# Altium schematic sheet PowerSupply.SchDoc
size A4; SheetNumber: 2; SheetTotal: 5
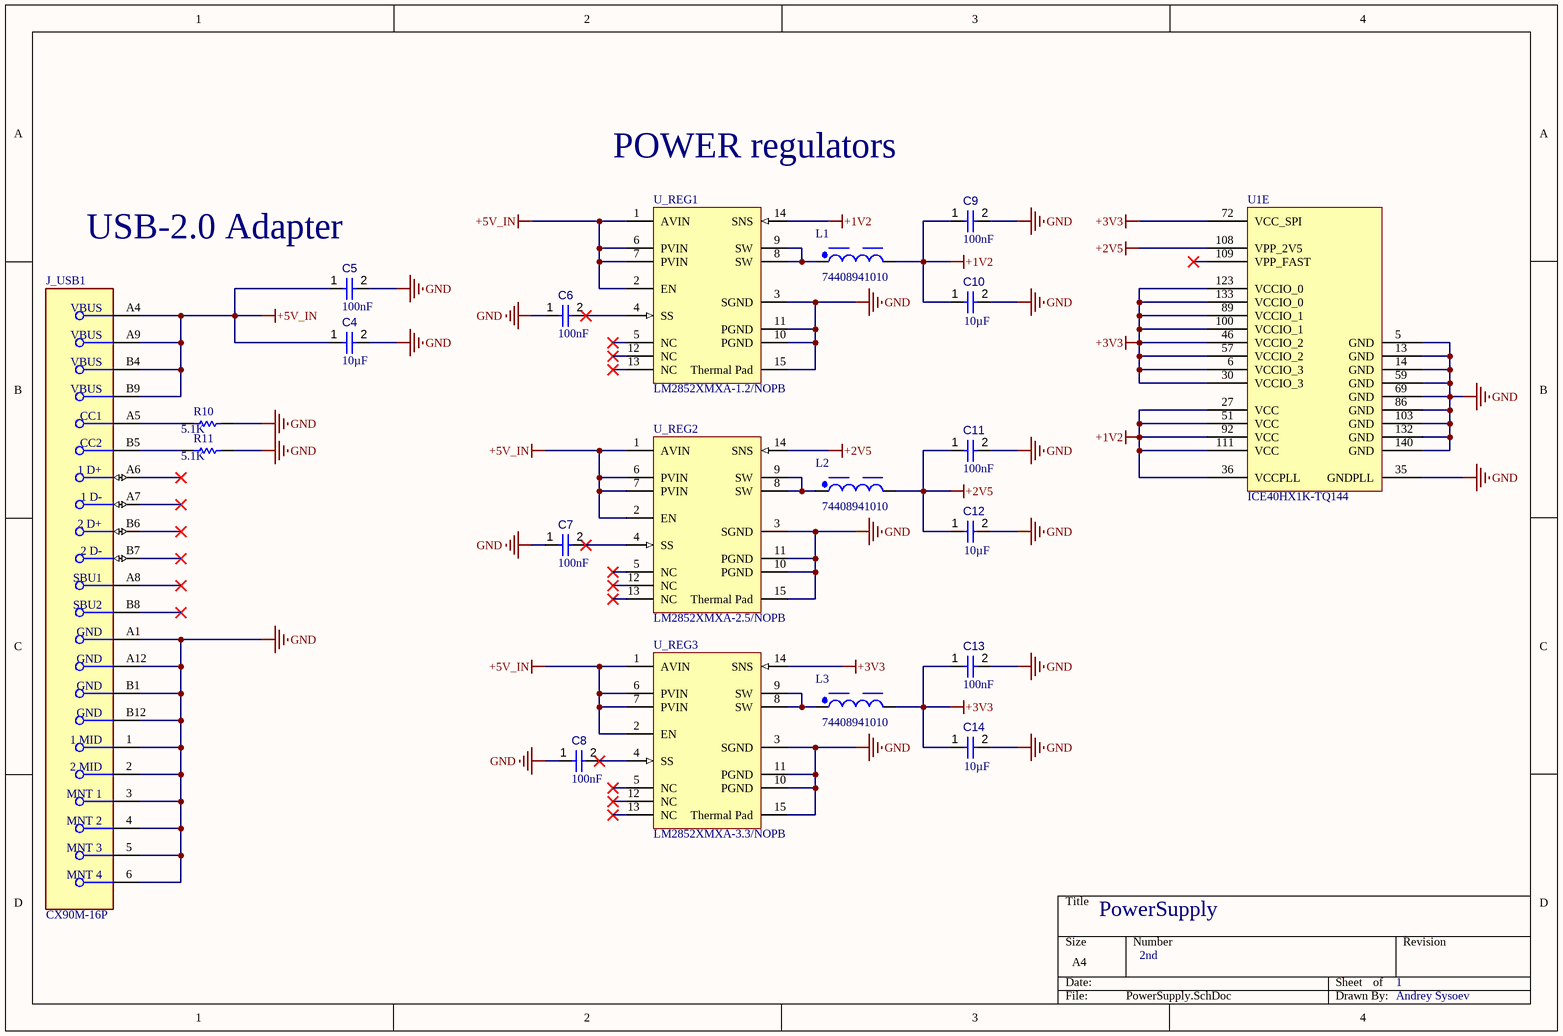
[diagram p0: PowerSupply.SchDoc]

## Parts
C11  value 100nF  [CAPC0402(1005)60_L]  (hidden comment: Capacitor 100nF +/-20% 50V 0402)
C12  value 10µF  [CAPC0603(1608)100_L]  (hidden comment: Capacitor 10µF +/-20% 10V 0603)
C13  value 100nF  [CAPC0402(1005)60_L]  (hidden comment: Capacitor 100nF +/-20% 50V 0402)
C14  value 10µF  [CAPC0603(1608)100_L]  (hidden comment: Capacitor 10µF +/-20% 10V 0603)
J_USB1  CX90M-16P  [FP-CX90M-16P-MFG]
L1  74408941010  [WE-SPC_4818]
L2  74408941010  [WE-SPC_4818]
L3  74408941010  [WE-SPC_4818]
R10  5.1K  [RESC2512(6432)_M]
R11  5.1K  [RESC2512(6432)_M]
U1  ICE40HX1K-TQ144  [LATC-TQFP-144_N]  (part E of 6)
U_REG1  LM2852XMXA-1.2/NOPB  [MXA14A_N]
U_REG2  LM2852XMXA-2.5/NOPB  [MXA14A_N]
U_REG3  LM2852XMXA-3.3/NOPB  [MXA14A_N]
С4  value 10µF  [CAPC0603(1608)100_L]  (hidden comment: Capacitor 10µF +/-20% 10V 0603)
С5  value 100nF  [CAPC0402(1005)60_L]  (hidden comment: Capacitor 100nF +/-20% 50V 0402)
С6  value 100nF  [CAPC0402(1005)60_L]  (hidden comment: Capacitor 100nF +/-20% 50V 0402)
С7  value 100nF  [CAPC0402(1005)60_L]  (hidden comment: Capacitor 100nF +/-20% 50V 0402)
С8  value 100nF  [CAPC0402(1005)60_L]  (hidden comment: Capacitor 100nF +/-20% 50V 0402)
С9  value 100nF  [CAPC0402(1005)60_L]  (hidden comment: Capacitor 100nF +/-20% 50V 0402)
С10  value 10µF  [CAPC0603(1608)100_L]  (hidden comment: Capacitor 10µF +/-20% 10V 0603)

## Nets
+1V2: L1.2 U1.27(VCC) U1.36(VCCPLL) U1.51(VCC) U1.92(VCC) U1.111(VCC) U_REG1.14(SNS) С9.1 С10.1
+2V5: C11.1 C12.1 L2.2 U1.108(VPP_2V5) U_REG2.14(SNS)
+3V3: C13.1 C14.1 L3.2 U1.6(VCCIO_3) U1.30(VCCIO_3) U1.46(VCCIO_2) U1.57(VCCIO_2) U1.72(VCC_SPI) U1.89(VCCIO_1) U1.100(VCCIO_1) U1.123(VCCIO_0) U1.133(VCCIO_0) U_REG3.14(SNS)
+5V_IN: J_USB1.A4(VBUS) J_USB1.A9(VBUS) J_USB1.B4(VBUS) J_USB1.B9(VBUS) U_REG1.1(AVIN) U_REG1.2(EN) U_REG1.6(PVIN) U_REG1.7(PVIN) U_REG2.1(AVIN) U_REG2.2(EN) U_REG2.6(PVIN) U_REG2.7(PVIN) U_REG3.1(AVIN) U_REG3.2(EN) U_REG3.6(PVIN) U_REG3.7(PVIN) С4.1 С5.1
GND: C11.2 C12.2 C13.2 C14.2 J_USB1.1(1_MID) J_USB1.2(2_MID) J_USB1.3(MNT_1) J_USB1.4(MNT_2) J_USB1.5(MNT_3) J_USB1.6(MNT_4) J_USB1.A1(GND) J_USB1.A12(GND) J_USB1.B1(GND) J_USB1.B12(GND) R10.2 R11.2 U1.5(GND) U1.13(GND) U1.14(GND) U1.35(GNDPLL) U1.59(GND) U1.69(GND) U1.86(GND) U1.103(GND) U1.132(GND) U1.140(GND) U_REG1.3(SGND) U_REG1.10(PGND) U_REG1.11(PGND) U_REG1.15(Thermal_Pad) U_REG2.3(SGND) U_REG2.10(PGND) U_REG2.11(PGND) U_REG2.15(Thermal_Pad) U_REG3.3(SGND) U_REG3.10(PGND) U_REG3.11(PGND) U_REG3.15(Thermal_Pad) С4.2 С5.2 С6.1 С7.1 С8.1 С9.2 С10.2
NetJ_USB1_A5: J_USB1.A5(CC1) R10.1
NetJ_USB1_B5: J_USB1.B5(CC2) R11.1
NetL1_1: L1.1 U_REG1.8(SW) U_REG1.9(SW)
NetL2_1: L2.1 U_REG2.8(SW) U_REG2.9(SW)
NetL3_1: L3.1 U_REG3.8(SW) U_REG3.9(SW)
NetU_REG1_4: U_REG1.4(SS) С6.2
NetU_REG2_4: U_REG2.4(SS) С7.2
NetU_REG3_4: U_REG3.4(SS) С8.2

Not connected (* = marked no-connect by the designer): J_USB1 A6(1_D+)* A7(1_D-)* A8(SBU1)* B6(2_D+)* B7(2_D-)* B8(SBU2)*; U1 109(VPP_FAST)*; U_REG1 5(NC)* 12(NC)* 13(NC)*; U_REG2 5(NC)* 12(NC)* 13(NC)*; U_REG3 5(NC)* 12(NC)* 13(NC)*

## Notes on the sheet
- POWER regulators
- (near С5) USB-2.0 Adapter
- PowerSupply
- 2nd
- 1
- Andrey Sysoev

## Library data of the parts
C11 C13 С5-С9 = CMP-001-00067-3: Chip Capacitor, 100nF +/-20%, 50V, 0402, Thickness 0.6 mm; Tolerance: 10%; Min Operating Temperature: -55°C; Pins: 2; Case/Package: 0402; Max Operating Temperature: 85°C; Voltage Rating: 50V; Mounting Technology: SMT
C12 C14 С4 С10 = CMP-001-00075-4: Chip Capacitor, 10µF +/-20%, 10V, 0603, Thickness 1 mm; Tolerance: 10%; Voltage Rating: 10V; Max Operating Temperature: 85°C; Pins: 2; Case/Package: 0603; Mounting Technology: SMT; Min Operating Temperature: -55°C
J_USB1 = CMP-031-00012-1: USB Connector, USB Type C, USB 2.0, Receptacle, 16 Ways, Surface Mount, Right Angle; Pins: 16; Max Operating Temperature: 85°C; Min Operating Temperature: -40°C
L1-L3 = CMP-031-00017-1: Power Choke Shielded Wirewound 1uH 20% 100KHz Ferrite 3A 0.0295Ohm DCR T/R; Max Operating Temperature: 125°C; Pins: 2; Min Operating Temperature: -40°C
R10 R11 = CMP-031-00013-1: Fixed Resistor, Metal Glaze/Thick Film, 1W, 5.1ohm, 500V, 5% +/-Tol, Surface Mount, 2512; Mounting Technology: Surface Mount; Min Operating Temperature: -55°C; Case/Package: 2512; Max Operating Temperature: 155°C
U1 = CMP-031-00018-1: FPGA iCE40 HX Family 1280 Cells 40nm Technology 1.2V 144-Pin TQFP Tray; Max Supply Voltage: 1.26V; Min Supply Voltage: 1.14V; Pins: 144; Case/Package: LFQFP; Max Operating Temperature: 85°C; Min Operating Temperature: -40°C
U_REG1 = CMP-031-00019-1: 2A 500/1500kHz Synchronous Buck Regulator 14-HTSSOP -40 to 125; Max Supply Voltage: 5.5V; Pins: 14; Max Operating Temperature: 125°C; Case/Package: HTSSOP EP; Mounting Technology: Surface Mount; Min Operating Temperature: -40°C
U_REG2 = CMP-031-00020-1: 2A 500/1500kHz Synchronous Buck Regulator 14-HTSSOP -40 to 125; Max Supply Voltage: 5.5V; Min Supply Voltage: 2.85V; Max Operating Temperature: 125°C; Mounting Technology: Surface Mount; Pins: 14; Min Operating Temperature: -40°C; Case/Package: HTSSOP EP
U_REG3 = CMP-031-00015-1: 2A 500/1500kHz Synchronous Buck Regulator 14-HTSSOP -40 to 125; Min Supply Voltage: 2.85V; Max Supply Voltage: 5.5V; Max Operating Temperature: 125°C; Case/Package: HTSSOP EP; Min Operating Temperature: -40°C; Pins: 14; Mounting Technology: Surface Mount